# Altium schematic sheet Power.SchDoc
size A4
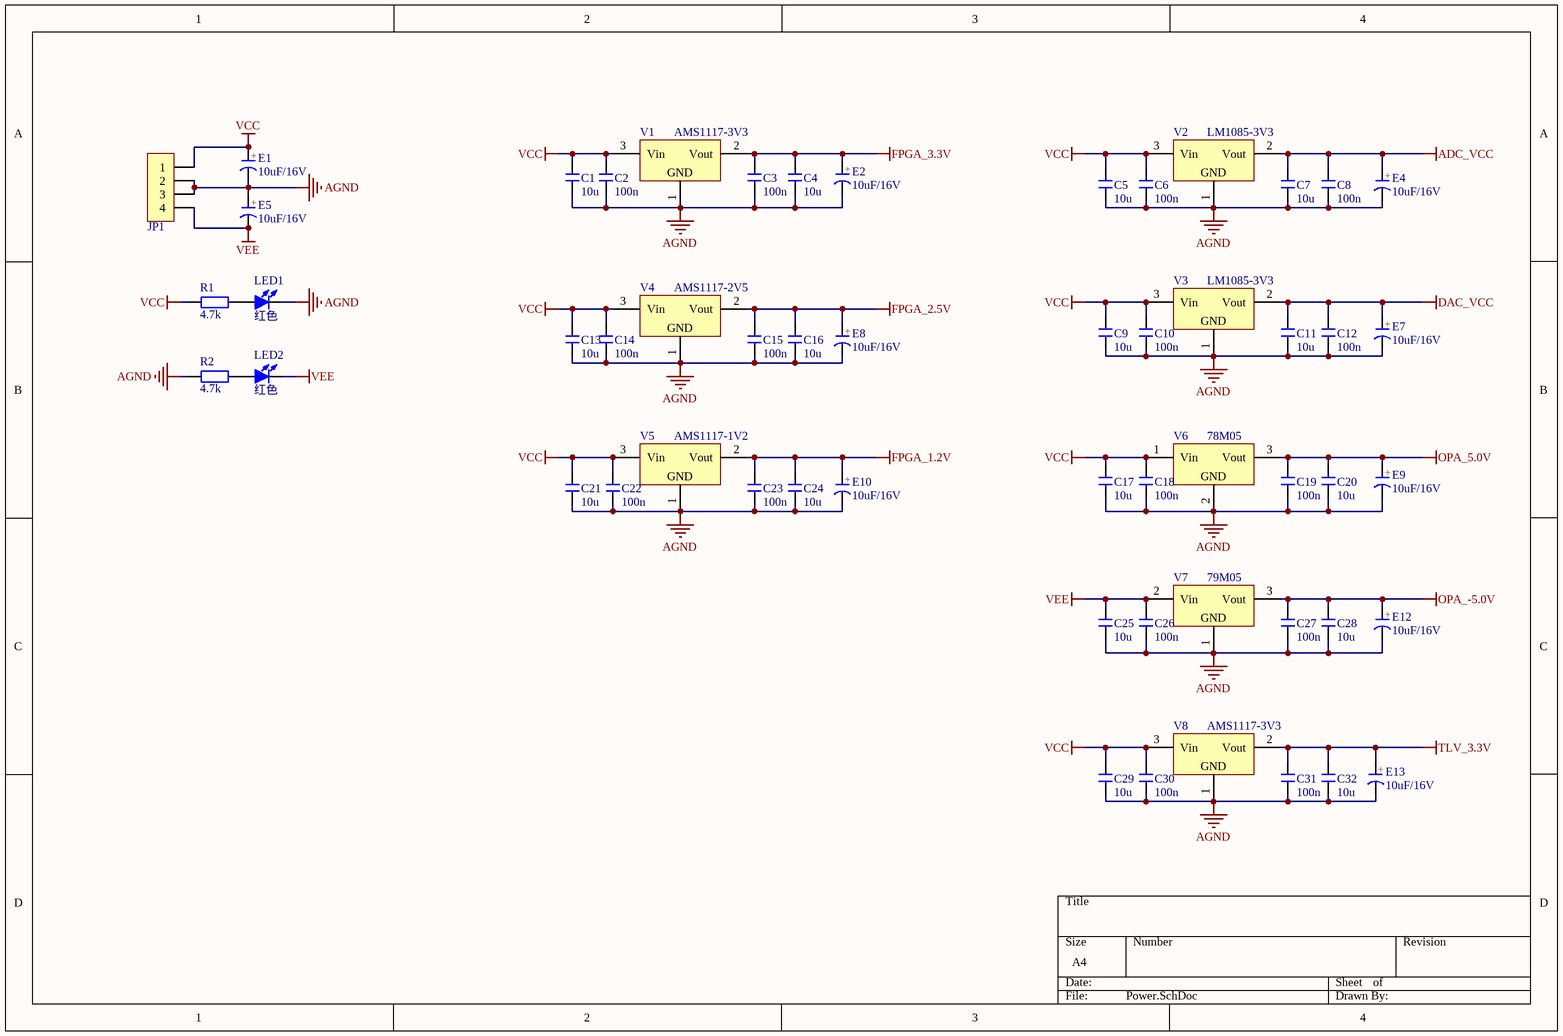
[diagram p0: Power.SchDoc]

## Parts
C1  10u  [C 0805_M]
C2  100n  [C 0805_M]
C3  100n  [C 0805_M]
C4  10u  [C 0805_M]
C5  10u  [C 0805_M]
C6  100n  [C 0805_M]
C7  10u  [C 0805_M]
C8  100n  [C 0805_M]
C9  10u  [C 0805_M]
C10  100n  [C 0805_M]
C11  10u  [C 0805_M]
C12  100n  [C 0805_M]
C13  10u  [C 0805_M]
C14  100n  [C 0805_M]
C15  100n  [C 0805_M]
C16  10u  [C 0805_M]
C17  10u  [C 0805_M]
C18  100n  [C 0805_M]
C19  100n  [C 0805_M]
C20  10u  [C 0805_M]
C21  10u  [C 0805_M]
C22  100n  [C 0805_M]
C23  100n  [C 0805_M]
C24  10u  [C 0805_M]
C25  10u  [C 0805_M]
C26  100n  [C 0805_M]
C27  100n  [C 0805_M]
C28  10u  [C 0805_M]
C29  10u  [C 0805_M]
C30  100n  [C 0805_M]
C31  100n  [C 0805_M]
C32  10u  [C 0805_M]
E1  10uF/16V  [C 1210_M]
E2  10uF/16V  [C 1210_M]
E4  10uF/16V  [C 1210_M]
E5  10uF/16V  [C 1210_M]
E7  10uF/16V  [C 1210_M]
E8  10uF/16V  [C 1210_M]
E9  10uF/16V  [C 1210_M]
E10  10uF/16V  [C 1210_M]
E12  10uF/16V  [C 1210_M]
E13  10uF/16V  [C 1210_M]
JP1  HDR-1X4  [KF2510-LI-4P]  (value not drawn)
LED1  红色  [LED 0805G]
LED2  红色  [LED 0805G]
R1  4.7k  [R 0805_M]
R2  4.7k  [R 0805_M]
V1  AMS1117-3V3  [SOT223_M]
V2  LM1085-3V3  [TO263]
V3  LM1085-3V3  [TO263]
V4  AMS1117-2V5  [SOT223_M]
V5  AMS1117-1V2  [SOT223_M]
V6  78M05  [TO263]
V7  79M05  [TO263]
V8  AMS1117-3V3  [SOT223_M]

## Nets
ADC_VCC: C7.2 C8.2 E4.1(A) V2.2(Vout)
AGND: C1.1 C2.1 C3.1 C4.1 C5.1 C6.1 C7.1 C8.1 C9.1 C10.1 C11.1 C12.1 C13.1 C14.1 C15.1 C16.1 C17.1 C18.1 C19.1 C20.1 C21.1 C22.1 C23.1 C24.1 C25.1 C26.1 C27.1 C28.1 C29.1 C30.1 C31.1 C32.1 E1.2(K) E2.2(K) E4.2(K) E5.1(A) E7.2(K) E8.2(K) E9.2(K) E10.2(K) E12.2(K) E13.2(K) JP1.2 JP1.3 LED1.2(K) R2.1 V1.1(GND) V2.1(GND) V3.1(GND) V4.1(GND) V5.1(GND) V6.2(GND) V7.1(GND) V8.1(GND)
DAC_VCC: C11.2 C12.2 E7.1(A) V3.2(Vout)
FPGA_1.2V: C23.2 C24.2 E10.1(A) V5.2(Vout)
FPGA_2.5V: C15.2 C16.2 E8.1(A) V4.2(Vout)
FPGA_3.3V: C3.2 C4.2 E2.1(A) V1.2(Vout)
OPA_5.0V: C19.2 C20.2 E9.1(A) V6.3(Vout)
OPA_-5.0V: C27.2 C28.2 E12.1(A) V7.3(Vout)
TLV_3.3V: C31.2 C32.2 E13.1(A) V8.2(Vout)
VCC: C1.2 C2.2 C5.2 C6.2 C9.2 C10.2 C13.2 C14.2 C17.2 C18.2 C21.2 C22.2 C29.2 C30.2 E1.1(A) JP1.1 R1.1 V1.3(Vin) V2.3(Vin) V3.3(Vin) V4.3(Vin) V5.3(Vin) V6.1(Vin) V8.3(Vin)
VEE: C25.2 C26.2 E5.2(K) JP1.4 LED2.2(K) V7.2(Vin)
NetLED1_1: LED1.1(A) R1.2
NetLED2_1: LED2.1(A) R2.2

## Notes on the sheet
- (in symbol C-CAP) +

## Library data of the parts
C1-C32 = C: 无极性贴片电容; 版权归属: 源创客; BOM名称: 无极性贴片电容; 学习资源: www.ooocke.com
E1 E2 E4 E5 E7-E10 E12 E13 = C-CAP: 直插电解电容; 版权归属: 源创客; BOM名称: 直插电解电容; 学习资源: www.ooocke.com
JP1 = Header 4: 4P接插件; 版权归属: 源创客; BOM名称: 4P接插件; 学习资源: www.ooocke.com
LED1 LED2 = LED-SMD: 贴片LED; 版权归属: 源创客; BOM名称: 贴片LED; 学习资源: www.ooocke.com
R1 R2 = R: 贴片电阻; 版权归属: 源创客; BOM名称: 贴片电阻; 学习资源: www.ooocke.com
V1-V8 = AMS1117: 三端稳压芯片; BOM名称: 稳压芯片; 版权归属: 源创客; 学习资源: www.ooocke.com